# Altium schematic sheet 09_CAN.SchDoc
size 420 x 297 mm; SheetNumber: 9; SheetTotal: 12
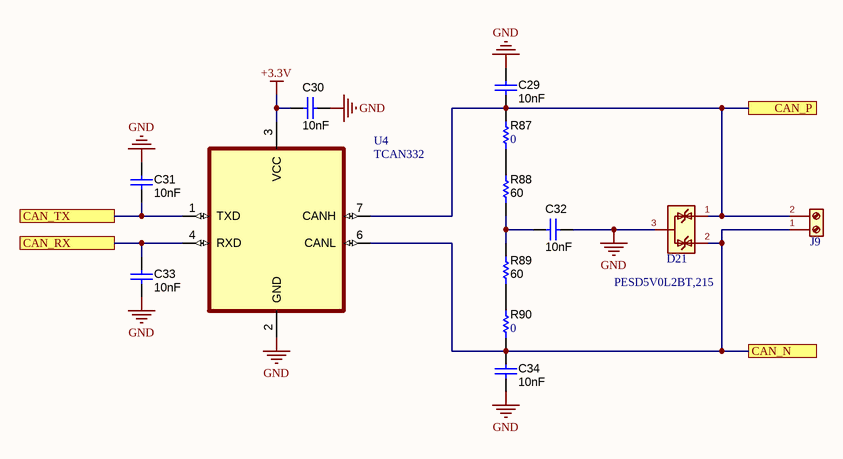
[diagram p0: 09_CAN.SchDoc]

## Parts
C29  ValueDisplayed: 10nF  [0603]  (hidden comment: CAP 10nF 0603)
C30  ValueDisplayed: 10nF  [0603]  (hidden comment: CAP 10nF 0603)
C31  ValueDisplayed: 10nF  [0603]  (hidden comment: CAP 10nF 0603)
C32  ValueDisplayed: 10nF  [0603]  (hidden comment: CAP 10nF 0603)
C33  ValueDisplayed: 10nF  [0603]  (hidden comment: CAP 10nF 0603)
C34  ValueDisplayed: 10nF  [0603]  (hidden comment: CAP 10nF 0603)
D21  PESD5V0L2BT,215  [SOT-23]
J9  Terminal_01x02_P5.00  [TerminalBlock_Phoenix_PT-1,5-2-5.0-H_1x02_P5.00mm_Horizontal]  (value not drawn)
R87  ValueDisplayed: 0  [0402L]  (hidden comment: ERJ-2GE0R00X)
R88  ValueDisplayed: 60  [0603]  (hidden comment: MCT06030Z0000ZP500)
R89  ValueDisplayed: 60  [0603]  (hidden comment: MCT06030Z0000ZP500)
R90  ValueDisplayed: 0  [0402L]  (hidden comment: ERJ-2GE0R00X)
U4  TCAN332  [SOIC127P599X175-8N]

## Ports
CAN_N, CAN_P, CAN_RX (see 04_STM32F373VBTx[6B]), CAN_TX (see 04_STM32F373VBTx[6B])

## Nets
+3.3V: C30.2 U4.3(VCC)
GND: C29.1 C30.1 C31.1 C32.1 C33.2 C34.2 D21.3(A) U4.2(GND)
CAN_N: C34.1 D21.2(K) J9.1(Pin_1) R90.1 U4.6(CANL) ; port CAN_N
CAN_P: C29.2 D21.1(K) J9.2(Pin_2) R87.2 U4.7(CANH) ; port CAN_P
CAN_RX: C33.1 U4.4(RXD) ; port CAN_RX
CAN_TX: C31.2 U4.1(TXD) ; port CAN_TX
NetC32_2: C32.2 R88.1 R89.2
NetR87_1: R87.1 R88.2
NetR89_1: R89.1 R90.2

## Notes on the sheet
- Sub-system:
- Project:
- Design by:
- Sheet title:
- Sheet
- of
- Checked by:
- Approved by:
- Doc No:
- Revision:
- Size:
- Date:
- A3

## Library data of the parts
C29-C34 = CAP 10nF 0603: CAP, CERM, 10 nF, 50 V, +/- 10%, X7R, AEC-Q200 Grade 1, 0603; Manufacturer: MuRata; PartNumber: GCM188R70J225KE22D; TaMin_C: -55°C; Polarized: N; SizeAreaWB_mm2: 4.68; Value1: Unknown; U/M: EA; Value: 2.2uF; TaMax_C: 125°C; SizeZ_mm: 1; SizeX_mm: 1.6; SizeY_mm: 0.8; Value2: 6.3V; SizeArea_mm2: 1.28; CompType: Capacitor; AEC Qualified: Y; Cap_F: 2.2µF; AEC Category: Q200; Supplier Part Number 2: 81-GCM188R70J225KE2D; Publisher: Texas Instruments; Supplier 2: Mouser; TempCo: X7R; Published: 2008-06-19; RoHS: Y; MountType: SMT; Supplier 1: Digi-Key; PackageReference: 0603; Tolerance_%: 10%; Cap_Case: 0603; LatestRevisionDate: 2017-03-09; VDC_V: 6.3V; ComponentLink1Description: Datasheet link; AEC Grade: 1; Supplier Part Number 1: 490-5316-1-ND; Technology: Ceramic; ComponentLink1URL: http://psearch.en.murata.com/capacitor/product/GCM188R70J225KE22%23.pdf
R87 R90 = RES 0R 0402 0.1W: RES, 0, 5%, 0.1 W, AEC-Q200 Grade 0, 0402; Manufacturer: Panasonic; Power_W: 100mW; TempCo: 600 ppm/C; Value_Code: 0000; Value: 0; EIA_Code: E24; SizeX_mm: 1; SizeY_mm: 0.5; SizeZ_mm: 0.6; Value2: 0.1W; CompType: Resistor; AEC Qualified: Y; VDC_V: 50V; AEC Category: Q200; SizeAreaWB_mm2: 3; Supplier Part Number 2: 65T8307; Supplier 2: Newark; Supplier Part Number 3: 667-ERJ-2GE0R00X; Supplier 3: Mouser; RoHS: Y; Value1: 5%; MountType: SMT; Supplier 1: Digi-Key; PackageReference: 0402; Tolerance_%: 5%; Res_ohm: 0; SizeArea_mm2: 0.5; PartNumber: ERJ-2GE0R00X; ComponentLink1Description: Datasheet link; Supplier Part Number 1: P0.0JCT-ND; Technology: Thick Film; ComponentLink1URL: https://industrial.panasonic.com/cdbs/www-data/pdf/RDA0000/AOA0000C301.pdf; AEC Grade: 0
R88 R89 = RES 60R 0603: RES, 60, 5%, 0.125 W, 0603; Manufacturer: Vishay/Beyschlag; Power_W: 125mW; TempCo: ppm/C; Value_Code: 0000; U/M: EA; Value: 0; EIA_Code: E24; SizeX_mm: 1.6; SizeY_mm: 0.8; SizeZ_mm: 1; Value2: 0.125W; SizeArea_mm2: 1.28; CompType: Resistor; AEC Qualified: N; AEC Category: Q200; Supplier Part Number 2: 96Y9454; Publisher: Texas Instruments; Supplier 2: Newark; Supplier Part Number 3: 594-MCT06030Z0000ZP5; Supplier 3: Mouser; Published: 2008-06-26; RoHS: Y; Value1: 5%; MountType: SMT; Supplier 1: Digi-Key; PackageReference: 0603; Tolerance_%: 5%; Res_ohm: 0; LatestRevisionDate: 2017-03-09; PartNumber: MCT06030Z0000ZP500; ComponentLink1Description: Datasheet link; AEC Grade: N/A; Supplier Part Number 1: MCT0603-0.0-ZZCT-ND; Technology: Thin Film; ComponentLink1URL: http://www.vishay.com/docs/28705/mcx0x0xpro.pdf
U4 = TCAN332DR: 3.3-V CAN Transceivers; MF: Texas Instruments; SnapEDA_Link: https://www.snapeda.com/parts/TCAN332DR/Texas+Instruments/view-part/?ref=snap; Package: SOIC-8 Texas Instruments; Value: *; MP: TCAN332DR; Check_prices: https://www.snapeda.com/parts/TCAN332DR/Texas+Instruments/view-part/?ref=eda